# Altium schematic sheet termial.SchDoc
size A4
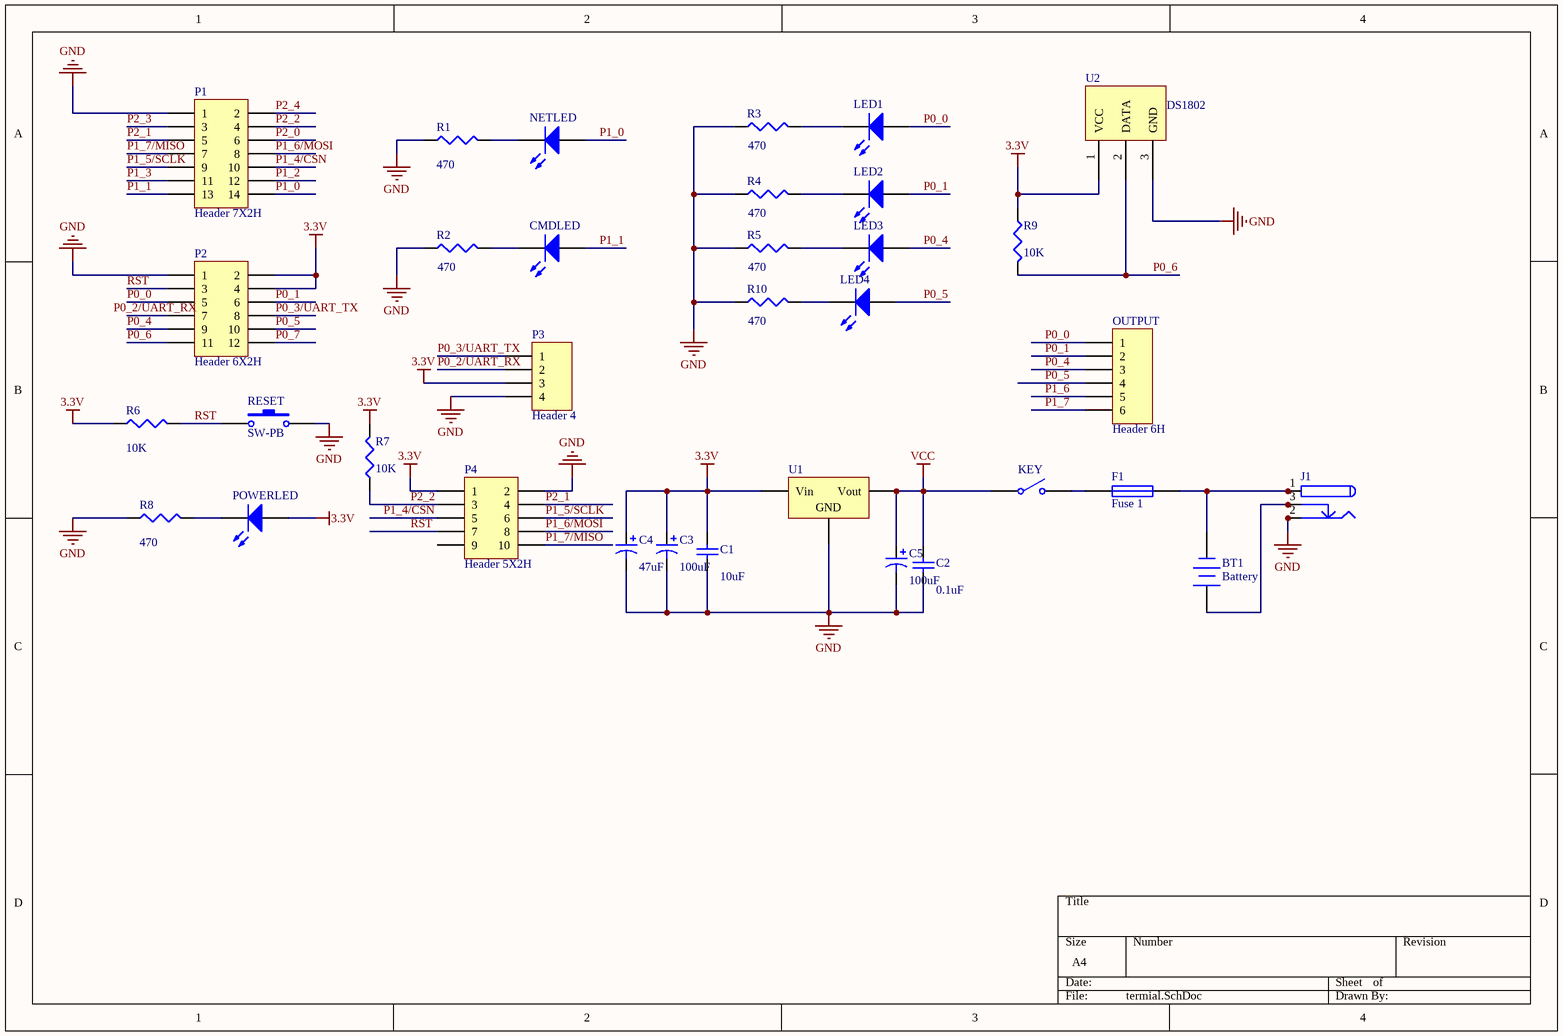
[diagram p0: termial.SchDoc]

## Parts
BT1  Battery  [BAT-2]
C1  value 10uF  [RAD-0.3]  (hidden comment: Cap)
C2  value 0.1uF  [RAD-0.3]  (hidden comment: Cap)
C3  value 100uF  [RB7.6-15]  (hidden comment: Cap Pol1)
C4  value 47uF  [RB7.6-15]  (hidden comment: Cap Pol1)
C5  value 100uF  [RB7.6-15]  (hidden comment: Cap Pol1)
CMDLED  LED1  [LED-1]  (value not drawn)
F1  Fuse 1  [PIN-W2/E2.8]
J1  PWR2.5  [KLD-0202]  (value not drawn)
KEY  SW-SPST  [SPST-2]  (value not drawn)
LED1  LED1  [LED-1]  (value not drawn)
LED2  LED1  [LED-1]  (value not drawn)
LED3  LED1  [LED-1]  (value not drawn)
LED4  LED3  [3.5X2.8X1.9]  (value not drawn)
NETLED  LED1  [LED-1]  (value not drawn)
OUTPUT  Header 6H  [HDR1X6H]
P1  Header 7X2H  [HDR2X7H]
P2  Header 6X2H  [HDR2X6H]
P3  Header 4  [HDR1X4]
P4  Header 5X2H  [HDR2X5H]
POWERLED  LED1  [LED-1]  (value not drawn)
R1  value 470  [J1-0603]  (hidden comment: Res3)
R2  value 470  [J1-0603]  (hidden comment: Res3)
R3  value 470  [J1-0603]  (hidden comment: Res3)
R4  value 470  [J1-0603]  (hidden comment: Res3)
R5  value 470  [J1-0603]  (hidden comment: Res3)
R6  value 10K  [J1-0603]  (hidden comment: Res3)
R7  value 10K  [J1-0603]  (hidden comment: Res3)
R8  value 470  [J1-0603]  (hidden comment: Res3)
R9  value 10K  [J1-0603]  (hidden comment: Res3)
R10  value 470  [J1-0603]  (hidden comment: Res3)
RESET  SW-PB  [SPST-2]
U1  Volt Reg  [D2PAK_N]  (value not drawn)
U2  DS1802

## Nets
3.3V: C1.2 C3.1 C4.1 P2.2 P2.4 P3.3 P4.1 POWERLED.1(A) R6.1 R7.2 R9.1 U1.1(Vin) U2.1(VCC)
GND: C1.1 C2.1 C3.2 C4.2 C5.2 J1.2 J1.2A J1.2B P1.1 P2.1 P3.4 P4.2 R1.1 R2.1 R3.1 R4.1 R5.1 R8.1 R10.1 RESET.2 U1.2(GND) U2.3(GND)
VCC: C2.2 C5.1 KEY.1(COMMON) U1.3(Vout)
P0_0: LED1.1(A) OUTPUT.1 P2.5
P0_1: LED2.1(A) OUTPUT.2 P2.6
P0_2/UART_RX: P3.2
P0_3/UART_TX: P2.8 P3.1
P0_4: LED3.1(A) OUTPUT.3 P2.9
P0_5: LED4.1(A) OUTPUT.4 P2.10
P0_6: P2.11 R9.2 U2.2(DATA)
P0_7: P2.12
P1_0: NETLED.1(A) P1.14
P1_1: CMDLED.1(A) P1.13
P1_2: P1.12
P1_3: P1.11
P1_4/CSN: P1.10 P4.5
P1_5/SCLK: P1.9 P4.6
P1_6: OUTPUT.5
P1_6/MOSI: P1.8 P4.8
P1_7: OUTPUT.6
P1_7/MISO: P1.7 P4.10
P2_0: P1.6
P2_1: P1.5 P4.4
P2_2: P1.4 P4.3 R7.1
P2_3: P1.3
P2_4: P1.2
RST: P2.3 P4.7 R6.2 RESET.1
NetBT1_1: BT1.1(+) J1.3 J1.3A J1.3B
NetBT1_2: BT1.2(-) F1.2 J1.1 J1.1A J1.1B
NetCMDLED_2: CMDLED.2(K) R2.2
NetF1_1: F1.1 KEY.2(NO)
NetLED1_2: LED1.2(K) R3.2
NetLED2_2: LED2.2(K) R4.2
NetLED3_2: LED3.2(K) R5.2
NetLED4_2: LED4.2(K) R10.2
NetNETLED_2: NETLED.2(K) R1.2
NetPOWERLED_2: POWERLED.2(K) R8.2

Not connected (* = marked no-connect by the designer): P2 7; P4 9

## Notes on the sheet
- Labels drawn without touching a wire or pin: P0_2/UART_RX

## Library data of the parts
BT1 = Battery: Multicell Battery; Published: 24-Mar-1999; LatestRevisionDate: 17-Jul-2002; LatestRevisionNote: Re-released for DXP Platform.; PackageReference: BAT-2; Publisher: Altium Limited; PackageDescription: Battery; 2 Leads
C1 C2 = Cap: Capacitor; Published: 8-Jun-2000; LatestRevisionDate: 17-Jul-2002; LatestRevisionNote: Re-released for DXP Platform.; PackageReference: RAD-0.3; Publisher: Altium Limited; PackageDescription: Radial Cap, Thru-Hole; 2 Leads; 0.3 in Pin Spacing
C3-C5 = Cap Pol1: Polarized Capacitor (Radial); Published: 8-Jun-2000; LatestRevisionDate: 17-Jul-2002; LatestRevisionNote: Re-released for DXP Platform.; PackageReference: RB7.6-15; Publisher: Altium Limited; PackageDescription: Polarized Capacitor (Radial); 2 Leads
CMDLED LED1-LED3 NETLED POWERLED = LED1: Typical RED GaAs LED; Published: 8-Jun-2000; LatestRevisionDate: 08-Jul-2005; LatestRevisionNote: Mech Layer 1 removed.; PackageReference: LED-1; Publisher: Altium Limited; PackageDescription: LED; 2 Leads
F1 = Fuse 1: Fuse; Published: 8-Jun-2000; LatestRevisionDate: 17-Jul-2002; LatestRevisionNote: Re-released for DXP Platform.; PackageReference: PIN-W2/E2.8; Publisher: Altium Limited; PackageDescription: Thru-Hole; 2 Leads
J1 = PWR2.5: Low Voltage Power Supply Connector; Published: 17-Dec-2003; DatasheetDocument: 09-May-2002; Publisher: Altium Limited; ComponentLink1Description: Manufacturer Link; ComponentLink1URL: http://domino.kycon.com/internet/Products.html
KEY = SW-SPST: Single-Pole, Single-Throw Switch; Published: 24-Mar-1999; LatestRevisionDate: 17-Jul-2002; LatestRevisionNote: Re-released for DXP Platform.; PackageReference: SPST-2; Publisher: Altium Limited; PackageDescription: Switch; 2 Leads
LED4 = LED3: Typical BLUE SiC LED; Published: 8-Jun-2000; LatestRevisionDate: 17-Dec-2003; LatestRevisionNote: PCB Footprint replaced.; DatasheetVersion: 16-Apr-2002; PackageVersion: 16-Apr-2002; PackageReference: 3.5X2.8X1.9; Publisher: Altium Limited; PackageDescription: SM LED; 2 C-Bend Leads; Body 3.5 x 2.8 x 1.9 mm, inc leads (LxWxH typ)
OUTPUT = Header 6H: Header, 6-Pin, Right Angle; LatestRevisionDate: 17-Jul-2002; LatestRevisionNote: Re-released for DXP Platform.; Publisher: Altium Limited
P1 = Header 7X2H: Header, 7-Pin, Dual row, Right Angle; LatestRevisionDate: 17-Jul-2002; LatestRevisionNote: Re-released for DXP Platform.; Publisher: Altium Limited
P2 = Header 6X2H: Header, 6-Pin, Dual row, Right Angle; LatestRevisionDate: 17-Jul-2002; LatestRevisionNote: Re-released for DXP Platform.; Publisher: Altium Limited
P3 = Header 4: Header, 4-Pin; LatestRevisionDate: 17-Jul-2002; LatestRevisionNote: Re-released for DXP Platform.; Publisher: Altium Limited
P4 = Header 5X2H: Header, 5-Pin, Dual row, Right Angle; LatestRevisionDate: 17-Jul-2002; LatestRevisionNote: Re-released for DXP Platform.; Publisher: Altium Limited
R1-R10 = Res3: Resistor; Published: 8-Jun-2000; LatestRevisionDate: 29-May-2009; LatestRevisionNote: IPC-7351 Footprint Added.; PackageReference: J1-0603; Publisher: Altium Limited; PackageDescription: Chip Resistor
RESET = SW-PB: Switch; Published: 24-Mar-1999; LatestRevisionDate: 17-Jul-2002; LatestRevisionNote: Re-released for DXP Platform.; PackageReference: SPST-2; Publisher: Altium Limited; PackageDescription: Switch; 2 Leads
U1 = Volt Reg: Voltage Regulator; Published: 24-Mar-1999; LatestRevisionDate: 29-May-2009; LatestRevisionNote: IPC-7351 Footprint Added.; PackageReference: D2PAK; Publisher: Altium Limited; PackageDescription: 3-Pin Transistor Outline Package 2.54 mm Pitch, 15.1 mm Lead Span